# Altium schematic sheet APD9328_FPGA_SUPPLY.SchDoc: FPGA SUPPLY
size A4; Author: NC; Revision: 1.0; SheetNumber: 14; SheetTotal: 14
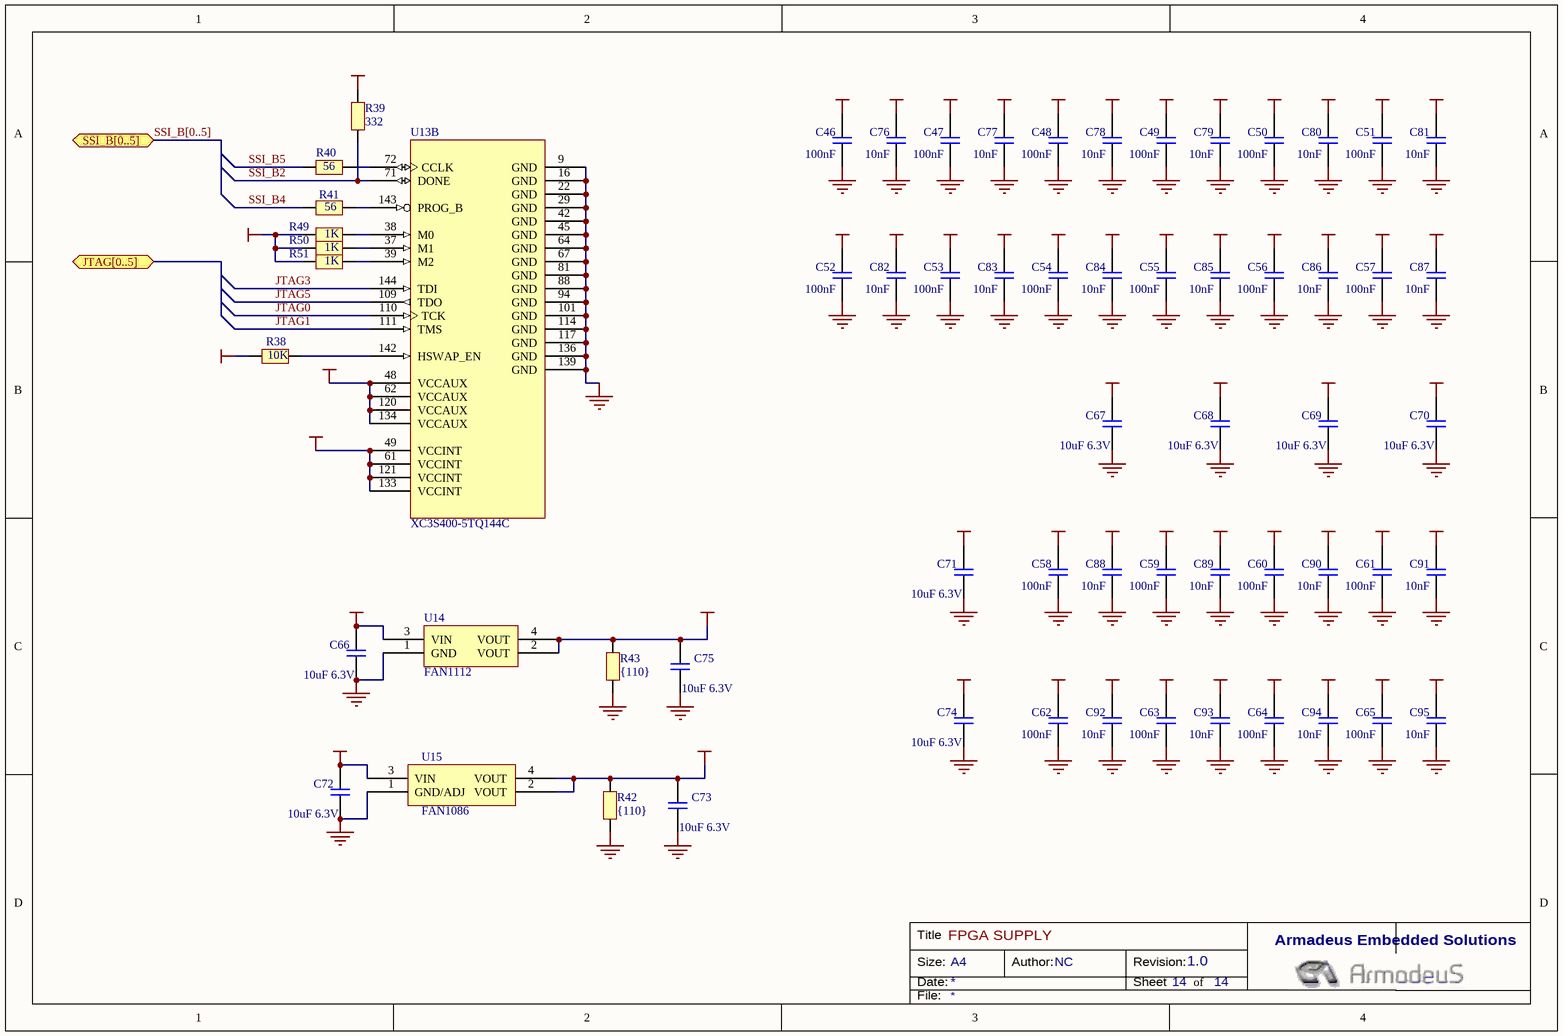
[diagram p0: APD9328_FPGA_SUPPLY.SchDoc]

## Parts
C46  100nF  [0402]
C47  100nF  [0402]
C48  100nF  [0402]
C49  100nF  [0402]
C50  100nF  [0402]
C51  100nF  [0402]
C52  100nF  [0402]
C53  100nF  [0402]
C54  100nF  [0402]
C55  100nF  [0402]
C56  100nF  [0402]
C57  100nF  [0402]
C58  100nF  [0402]
C59  100nF  [0402]
C60  100nF  [0402]
C61  100nF  [0402]
C62  100nF  [0402]
C63  100nF  [0402]
C64  100nF  [0402]
C65  100nF  [0402]
C66  10uF 6.3V  [0805]
C67  10uF 6.3V  [0805]
C68  10uF 6.3V  [0805]
C69  10uF 6.3V  [0805]
C70  10uF 6.3V  [0805]
C71  10uF 6.3V  [0805]
C72  10uF 6.3V  [0805]
C73  10uF 6.3V  [0805]
C74  10uF 6.3V  [0805]
C75  10uF 6.3V  [0805]
C76  10nF  [0402]
C77  10nF  [0402]
C78  10nF  [0402]
C79  10nF  [0402]
C80  10nF  [0402]
C81  10nF  [0402]
C82  10nF  [0402]
C83  10nF  [0402]
C84  10nF  [0402]
C85  10nF  [0402]
C86  10nF  [0402]
C87  10nF  [0402]
C88  10nF  [0402]
C89  10nF  [0402]
C90  10nF  [0402]
C91  10nF  [0402]
C92  10nF  [0402]
C93  10nF  [0402]
C94  10nF  [0402]
C95  10nF  [0402]
R38  10K  [0402]
R39  332  [0402]
R40  56  [0402]
R41  56  [0402]
R42  {110}  [0402]
R43  {110}  [0402]
R49  1K  [0402]
R50  1K  [0402]
R51  1K  [0402]
U13  XC3S400-5TQ144C  [TQ144]  (part B of 2)
U14  FAN1112  [SOT223]
U15  FAN1086  [SOT223]

## Ports
JTAG[0..5] (bidir), SSI_B[0..5] (bidir)

## Nets
+1V2: C62.2 C63.2 C64.2 C65.2 C74.2 C75.2 C92.2 C93.2 C94.2 C95.2 R43.2 U13.49(VCCINT) U13.61(VCCINT) U13.121(VCCINT) U13.133(VCCINT) U14.2(VOUT) U14.4(VOUT)
+2V5: C58.2 C59.2 C60.2 C61.2 C66.2 C71.2 C73.2 C88.2 C89.2 C90.2 C91.2 R38.1 R39.2 R42.2 R49.1 R50.1 R51.1 U13.48(VCCAUX) U13.62(VCCAUX) U13.120(VCCAUX) U13.134(VCCAUX) U14.3(VIN) U15.2(VOUT) U15.4(VOUT)
+3V3: C46.2 C47.2 C48.2 C49.2 C50.2 C51.2 C52.2 C53.2 C54.2 C55.2 C56.2 C57.2 C67.2 C68.2 C69.2 C70.2 C72.2 C76.2 C77.2 C78.2 C79.2 C80.2 C81.2 C82.2 C83.2 C84.2 C85.2 C86.2 C87.2 U15.3(VIN)
GND: C46.1 C47.1 C48.1 C49.1 C50.1 C51.1 C52.1 C53.1 C54.1 C55.1 C56.1 C57.1 C58.1 C59.1 C60.1 C61.1 C62.1 C63.1 C64.1 C65.1 C66.1 C67.1 C68.1 C69.1 C70.1 C71.1 C72.1 C73.1 C74.1 C75.1 C76.1 C77.1 C78.1 C79.1 C80.1 C81.1 C82.1 C83.1 C84.1 C85.1 C86.1 C87.1 C88.1 C89.1 C90.1 C91.1 C92.1 C93.1 C94.1 C95.1 R42.1 R43.1 U13.9(GND) U13.16(GND) U13.22(GND) U13.29(GND) U13.42(GND) U13.45(GND) U13.64(GND) U13.67(GND) U13.81(GND) U13.88(GND) U13.94(GND) U13.101(GND) U13.114(GND) U13.117(GND) U13.136(GND) U13.139(GND) U14.1(GND) U15.1(GND/ADJ)
JTAG0: U13.110(TCK)
JTAG1: U13.111(TMS)
JTAG3: U13.144(TDI)
JTAG5: U13.109(TDO)
SSI_B2: R39.1 U13.71(DONE)
SSI_B4: R41.1
SSI_B5: R40.1
NetR38_2: R38.2 U13.142(HSWAP_EN)
NetR40_2: R40.2 U13.72(CCLK)
NetR41_2: R41.2 U13.143(PROG_B)
NetR49_2: R49.2 U13.38(M0)
NetR50_2: R50.2 U13.37(M1)
NetR51_2: R51.2 U13.39(M2)

## Buses and harness runs
bus SSI_B[0..5] = port SSI_B[0..5]

## Notes on the sheet
- Title
- Size:
- Date:
- A4
- Author:
- Revision:
- Sheet
- of
- Armadeus Embedded Solutions
- File:

## Library data of the parts
C46-C65 C77-C95 = Cap: Assembly Option: X
C66-C75 = Cap: Ceramic Capacitor; Assembly Option: X; Manufacturer: *; Part Number: *; Distributor: *; Price: *; Second Source: *
C76 = Cap: Manufacturer: Kemet; Part Number: C0402C103K4RACTU; Assembly Option: X; Distributor: Mouser; Price_100: 0,025; Price_500: 0,020; Price_1000: 0,01
R38-R43 R49-R51 = Res: Assembly Option: X
U13 = XC3S400-5TQ144C: Spartan-3 1.2V FPGA, 97 User I/Os, 144-pin TQFP, High Performance, Commercial Grade; PackageDocument: ver1.1, Oct-2002; Published: 17-Sep-2003; DatasheetDocument: 04-Mar-2004; PackageReference: TQ144; Publisher: Altium Limited; Code_JEDEC: MS-026-BFB; Code_IPC: SQFP20X20-144
U14 = FAN1112: Linear Regulator; Manufacturer: Fairchild; Part Number: FAN1112SX; Assembly Option: X; Distributor: Mouser; Price_100: 0,63; Price_500: 0,39; Price_1000: 0,33
U15 = FAN1086: Manufacturer: *; Distributor: *